# EAGLE schematic wandercomputer (EAGLE 9.1.0)
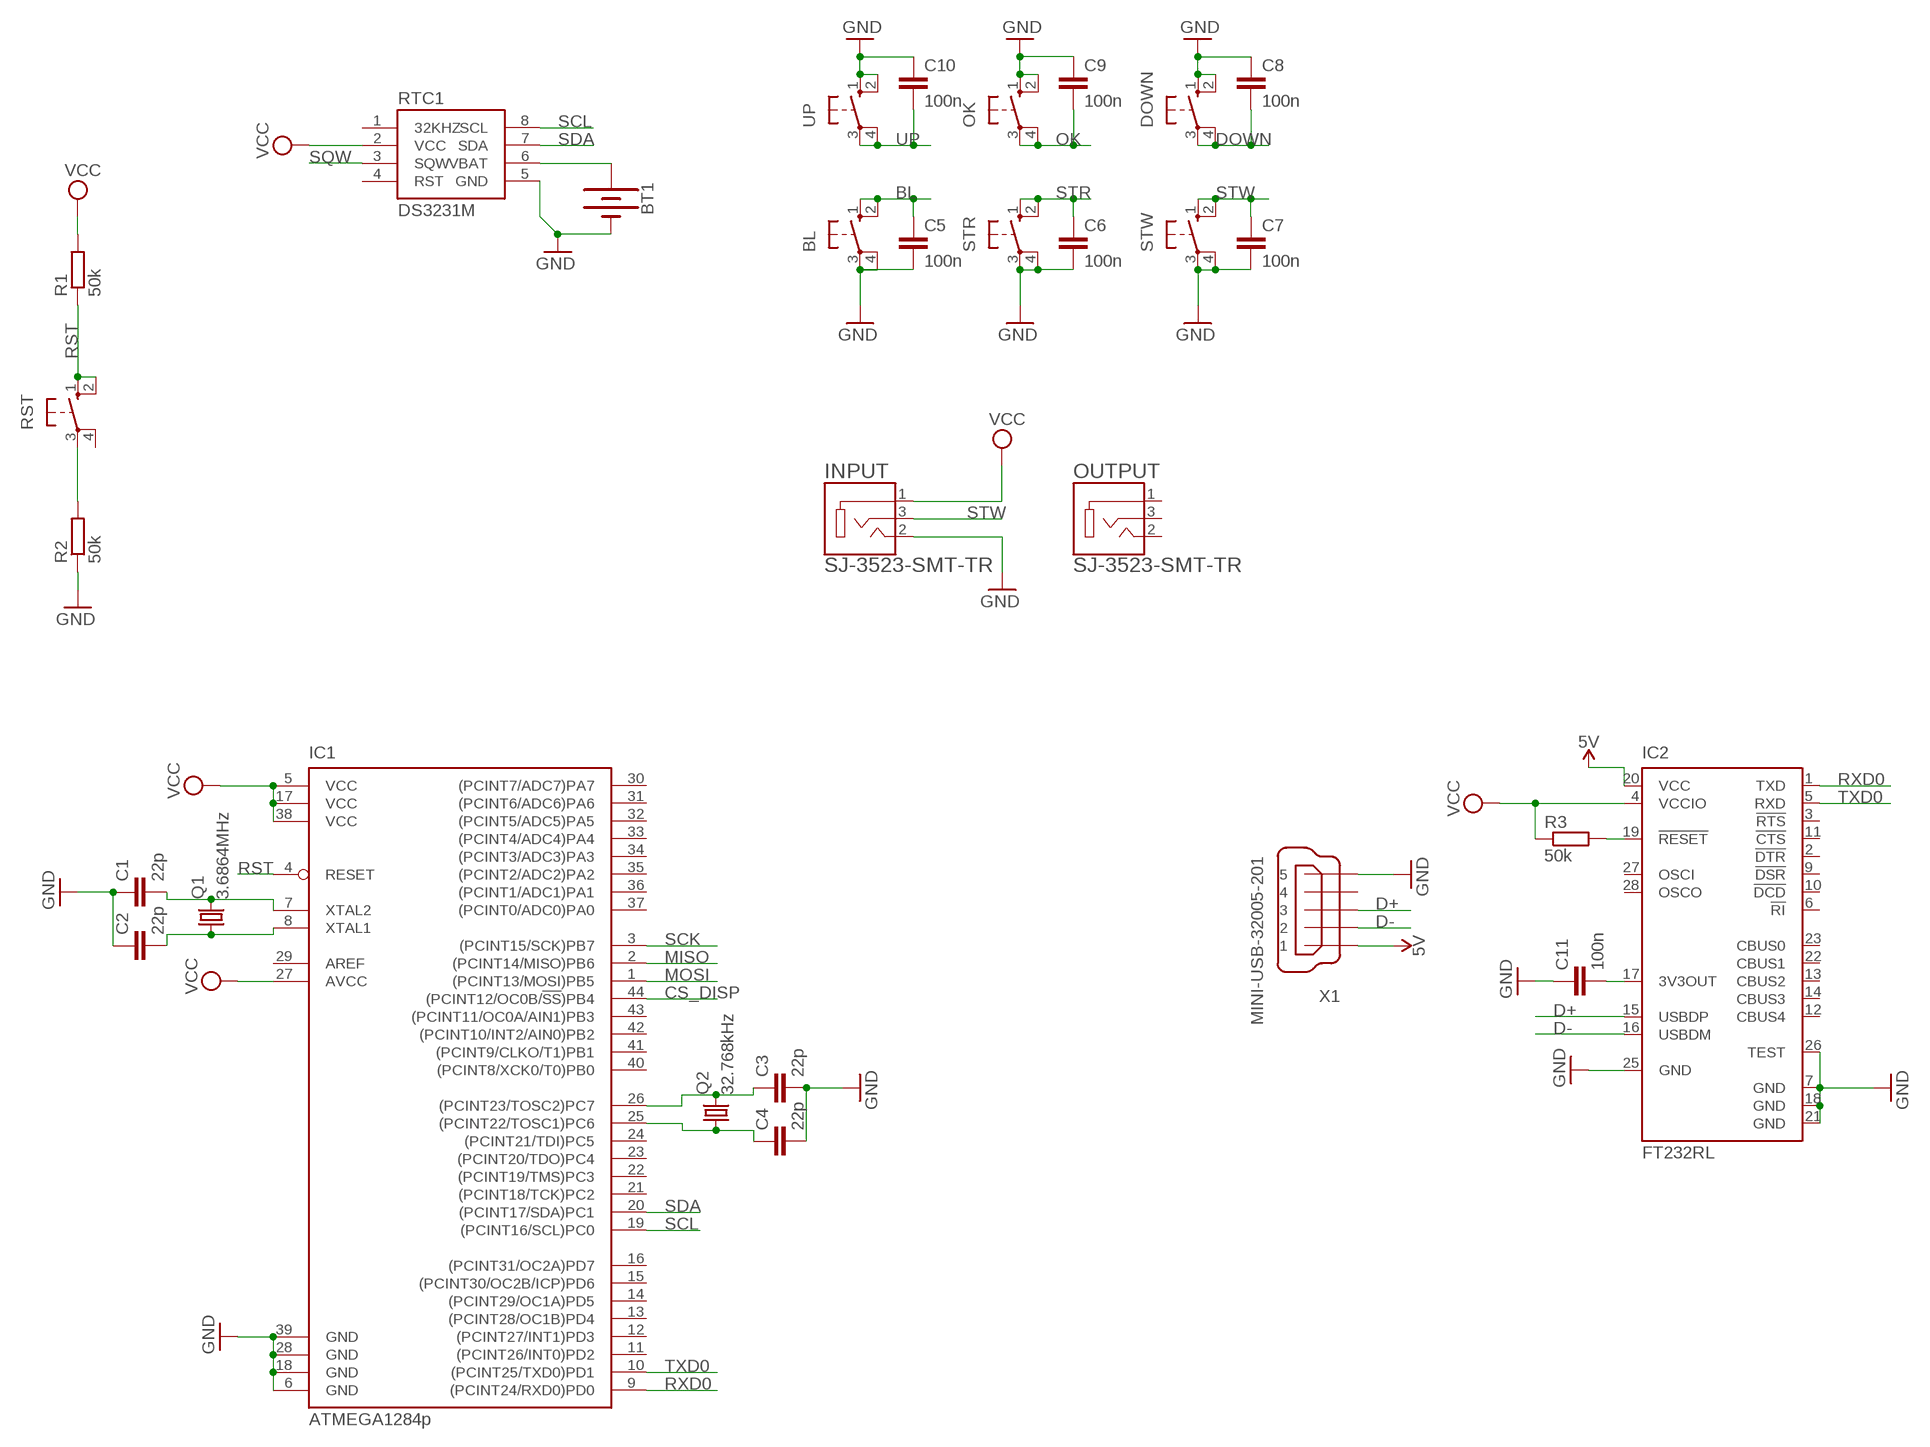
[diagram p0: schematic, sheet 1]

## Parts
BL  10-XX  [B3F-10XX]
BT1  BATTERY-20MM_SMD  [BATTCON_20MM]
C1  22p  C-EUC1808  [C1808]
C2  22p  C-EUC1808  [C1808]
C3  22p  C-EUC1808  [C1808]
C4  22p  C-EUC1808  [C1808]
C5  100n  C-EUC1808  [C1808]
C6  100n  C-EUC1808  [C1808]
C7  100n  C-EUC1808  [C1808]
C8  100n  C-EUC1808  [C1808]
C9  100n  C-EUC1808  [C1808]
C10  100n  C-EUC1808  [C1808]
C11  100n  C-EUC1808  [C1808]
DOWN  10-XX  [B3F-10XX]
IC1  ATMEGA1284p  ATMEGA644A  [TQFP44]
IC2  FT232RL  [SSOP28]
INPUT  SJ-3523-SMT-TR  [CUI_SJ-3523-SMT-TR]
OK  10-XX  [B3F-10XX]
OUTPUT  SJ-3523-SMT-TR  [CUI_SJ-3523-SMT-TR]
Q1  3.6864MHz  CRYSTALHC49U70  [HC49U70]
Q2  32.768kHz  CRYSTALTC26V  [TC26V]
R1  50k  R-EU_R3216  [R3216]
R2  50k  R-EU_R3216  [R3216]
R3  50k  R-EU_R3216  [R3216]
RST  10-XX  [B3F-10XX]
RTC1  DS3231M  [SO08]
STR  10-XX  [B3F-10XX]
STW  10-XX  [B3F-10XX]
UP  10-XX  [B3F-10XX]
X1  MINI-USB-32005-201  [32005-201]

## Nets
5V: IC2.20(VCC) X1.1
BL: BL.1(S) BL.2(S1) C5.1
CS_DISP: IC1.44((PCINT12/OC0B/!SS!)PB4)
D+: IC2.15(USBDP) X1.3
D-: IC2.16(USBDM) X1.2
DOWN: C8.2 DOWN.3(P) DOWN.4(P1)
GND: BL.3(P) BL.4(P1) BT1.2(-) C1.1 C2.1 C3.2 C4.2 C5.2 C6.2 C7.2 C8.1 C9.1 C10.1 C11.1 DOWN.1(S) DOWN.2(S1) IC1.6(GND) IC1.18(GND) IC1.28(GND) IC1.39(GND) IC2.7(GND) IC2.18(GND) IC2.21(GND) IC2.25(GND) IC2.26(TEST) INPUT.2 OK.1(S) OK.2(S1) R2.1 RTC1.5(GND) STR.3(P) STR.4(P1) STW.3(P) STW.4(P1) UP.1(S) UP.2(S1) X1.5
MISO: IC1.2((PCINT14/MISO)PB6)
MOSI: IC1.1((PCINT13/MOSI)PB5)
N$1: C3.1 IC1.26((PCINT23/TOSC2)PC7) Q2.2
N$2: C4.1 IC1.25((PCINT22/TOSC1)PC6) Q2.1
N$3: R2.2 RST.3(P)
N$4: C1.2 IC1.7(XTAL2) Q1.2
N$5: C2.2 IC1.8(XTAL1) Q1.1
N$6: C11.2 IC2.17(3V3OUT)
N$7: IC2.19(!RESET) R3.2
N$8: BT1.1(+) RTC1.6(VBAT)
OK: C9.2 OK.3(P) OK.4(P1)
RST: IC1.4(RESET) R1.1 RST.1(S) RST.2(S1)
RXD0: IC1.9((PCINT24/RXD0)PD0) IC2.1(TXD)
SCK: IC1.3((PCINT15/SCK)PB7)
SCL: IC1.19((PCINT16/SCL)PC0) RTC1.8(SCL)
SDA: IC1.20((PCINT17/SDA)PC1) RTC1.7(SDA)
SQW: RTC1.3(SQW)
STR: C6.1 STR.1(S) STR.2(S1)
STW: C7.1 INPUT.3 STW.1(S) STW.2(S1)
TXD0: IC1.10((PCINT25/TXD0)PD1) IC2.5(RXD)
UP: C10.2 UP.3(P) UP.4(P1)
VCC: IC1.5(VCC) IC1.17(VCC) IC1.27(AVCC) IC1.38(VCC) IC2.4(VCCIO) INPUT.1 R1.2 R3.1 RTC1.2(VCC)
Unconnected: IC1.11((PCINT26/INT0)PD2) IC1.12((PCINT27/INT1)PD3) IC1.13((PCINT28/OC1B)PD4) IC1.14((PCINT29/OC1A)PD5) IC1.15((PCINT30/OC2B/ICP)PD6) IC1.16((PCINT31/OC2A)PD7) IC1.21((PCINT18/TCK)PC2) IC1.22((PCINT19/TMS)PC3) IC1.23((PCINT20/TDO)PC4) IC1.24((PCINT21/TDI)PC5) IC1.29(AREF) IC1.30((PCINT7/ADC7)PA7) IC1.31((PCINT6/ADC6)PA6) IC1.32((PCINT5/ADC5)PA5) IC1.33((PCINT4/ADC4)PA4) IC1.34((PCINT3/ADC3)PA3) IC1.35((PCINT2/ADC2)PA2) IC1.36((PCINT1/ADC1)PA1) IC1.37((PCINT0/ADC0)PA0) IC1.40((PCINT8/XCK0/T0)PB0) IC1.41((PCINT9/CLKO/T1)PB1) IC1.42((PCINT10/INT2/AIN0)PB2) IC1.43((PCINT11/OC0A/AIN1)PB3) IC2.2(!DTR) IC2.3(!RTS) IC2.6(!RI) IC2.9(!DSR) IC2.10(!DCD) IC2.11(!CTS) IC2.12(CBUS4) IC2.13(CBUS2) IC2.14(CBUS3) IC2.22(CBUS1) IC2.23(CBUS0) IC2.27(OSCI) IC2.28(OSCO) OUTPUT.1 OUTPUT.2 OUTPUT.3 RST.4(P1) RTC1.1(32KHZ) RTC1.4(RST) X1.4

## Library data of the parts
BL DOWN OK RST STR STW UP = switch-omron:10-XX: OMRON SWITCH; MPN: B3F-1000; OC_FARNELL: 176432; OC_NEWARK: 36M3542
BT1 = SparkFun-Batteries:BATTERY: Battery - Single Cell A variety of battery chemistries, sizes, and footprints. Device List: 20MM_PTH - Coin Cell Battery Holder - 20mm (PTH) <https://www.sparkfun.com/products/783> 6.8MM_PTH - Coin Cell Battery Holder - 6.8MM(SMD) <https://www.digikey.com/product-detail/en/seiko-instruments/MS621FE-FL11E/728-1057-ND/1889208?WT.srch=1&gclid=CNOQ5a6LzdQCFZS2wAodXCkE0g> 12MM_SMD - Coin Cell Battery Holder - 12mm (SMD) <https://www.sparkfun.com/products/10592> 12MM_PTH - Coin Cell Battery Holder - 12mm (PTH) <https://www.sparkfun.com/products/7948> 20MM_SMD - 20mm Coin Cell Battery Holder (SMD) (2 legs) Used on the Big Time Watch Kit <https://www.sparkfun.com/products/11734> 20MM_SMD_4LEGS - Coin Cell Battery Holder - 20mm (SMD) <https://www.sparkfun.com/products/11892> 20MM_SMD_4LEGS_OVERPASTE - Coin Cell Battery Holder - 20mm (SMD) <https://www.sparkfun.com/products/11892> (Over-paste on the legs) 24.5MM_PTH - Coin Cell Battery Holder - 24.5mm (PTH) <https://www.sparkfun.com/products/8863> 9V - 9V Battery Holder - PC Mount Used on the SparkFun SparkPunk Sound Kit <https://www.sparkfun.com/products/11177> and SparkFun SparkPunk Sequencer Kit <https://www.sparkfun.com/products/12707> 18650 - Battery Holder - 18650 (PTH) <https://www.sparkfun.com/products/13113> AA - Battery Holder - 1xAA (PTH) <https://www.sparkfun.com/products/7949> AAA - Battery Holder - 1xAAA (PTH) <https://www.sparkfun.com/products/12718> AA_KIT - Battery Holder - 1xAA (PTH) <https://www.sparkfun.com/products/7949> Special kit package - pads only have exposed copper on one side of the board. AAA_KIT - Battery Holder - 1xAAA (PTH) <https://www.sparkfun.com/products/12718> Special kit package - pads only have exposed copper on one side of the board.; PROD_ID: BATT-11519
C1-C11 = rcl:C-EU: CAPACITOR, European symbol; SPICEPREFIX: C
IC1 = atmel:ATMEGA644: 8-bit Microcontroller with 64K Bytes In-System Programmable Flash Source: http://www.atmel.com/dyn/resources/prod_documents/doc2593.pdf; MPN: ATMEGA644PV-10AU; OC_FARNELL: 1455123; OC_NEWARK: 58M3748
IC2 = ftdichip:FT232R: Source: http://www.ftdichip.com/Documents/DataSheets/DS_FT232R_v104.pdf; MPN: FT232RL; OC_FARNELL: 1146032; OC_NEWARK: 91K9918
INPUT OUTPUT = SJ-3523-SMT-TR:SJ-3523-SMT-TR: Audio Jack Connector 3.5 mm Low Profile Surface Mount Stereo Jack, 3 Pin Right-Angle; MF: CUI Inc; STANDARD: Manufacturer recommendations
Q1 Q2 = crystal:CRYSTAL: CRYSTAL; OC_FARNELL: unknown; OC_NEWARK: unknown
R1-R3 = rcl:R-EU_: RESISTOR, European symbol; SPICEPREFIX: R
RTC1 = SparkFun-Clocks:DS3231M: DS3231M Real Time Clock Accuracy +/-5ppm. Battery Backup. 2.3V to 5.5V. Datasheet <https://cdn.sparkfun.com/datasheets/Dev/Beagle/DS3231M.pdf> SparkFun Products CryptoCape <https://www.sparkfun.com/products/12773> (DEV-12773) SparkFun CryptoShield <https://www.sparkfun.com/products/13183> (DEV-13183); PROD_ID: IC-11985
X1 = con-cypressindustries:MINI-USB-: MINI USB-B Conector Source: www.cypressindustries.com; OC_FARNELL: unknown; OC_NEWARK: unknown